# EAGLE design dos-partes (EAGLE 9.0.0)
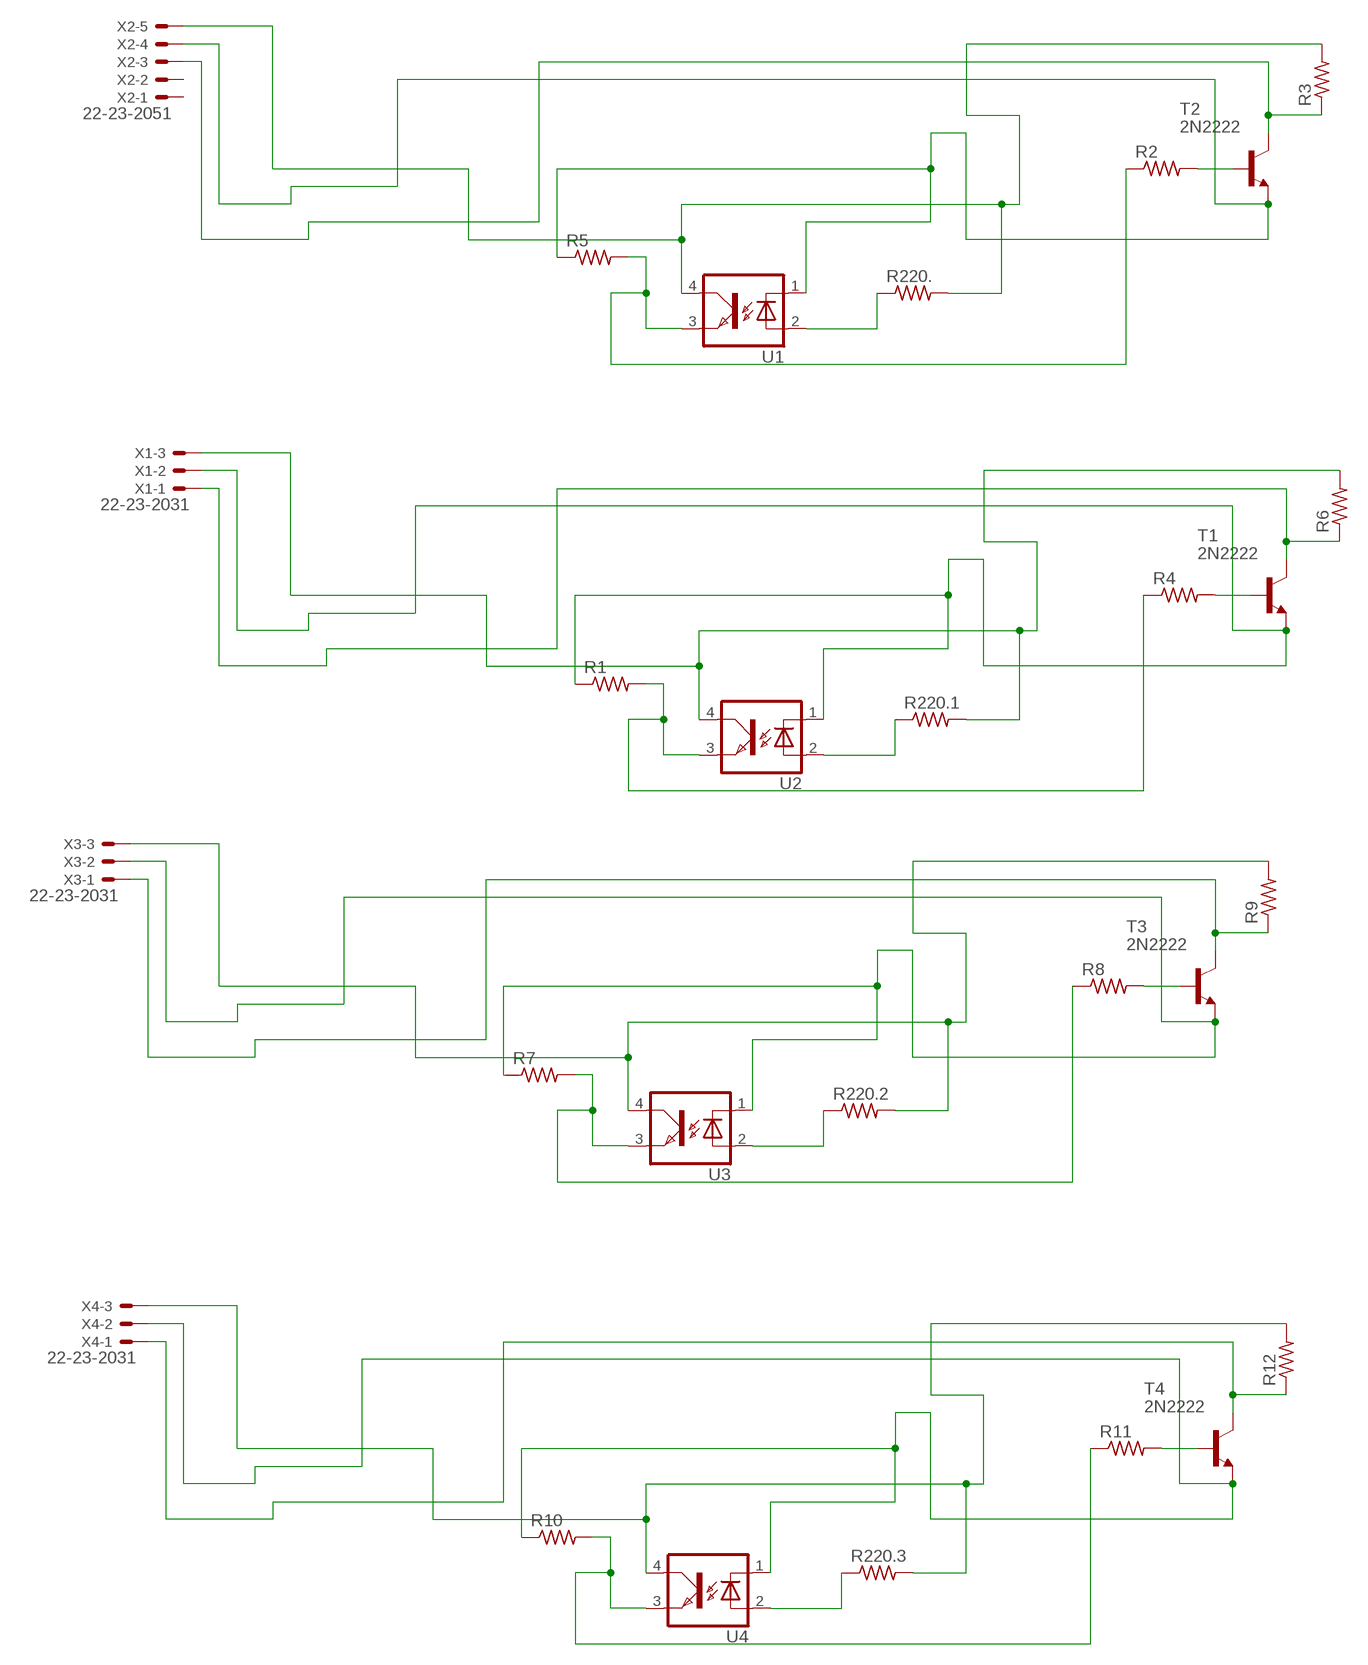
[diagram p0: schematic, sheet 1]

## Parts
R1  R-US_0204/7  [0204/7]
R2  R-US_0204/7  [0204/7]
R3  R-US_0204/7  [0204/7]
R4  R-US_0204/7  [0204/7]
R5  R-US_0204/7  [0204/7]
R6  R-US_0204/7  [0204/7]
R7  R-US_0204/7  [0204/7]
R8  R-US_0204/7  [0204/7]
R9  R-US_0204/7  [0204/7]
R10  R-US_0204/7  [0204/7]
R11  R-US_0204/7  [0204/7]
R12  R-US_0204/7  [0204/7]
R220.  R-US_0204/7  [0204/7]
R220.1  R-US_0204/7  [0204/7]
R220.2  R-US_0204/7  [0204/7]
R220.3  R-US_0204/7  [0204/7]
T1  2N2222  [TO18]
T2  2N2222  [TO18]
T3  2N2222  [TO18]
T4  2N2222  [TO18]
U1  CNY70  [CNY70]
U2  CNY70  [CNY70]
U3  CNY70  [CNY70]
U4  CNY70  [CNY70]
X1  22-23-2031  [22-23-2031]
X2  22-23-2051  [22-23-2051]
X3  22-23-2031  [22-23-2031]
X4  22-23-2031  [22-23-2031]

## Nets
N$1: R220..1 U1.2
N$4: R5.1 T2.1(E) U1.1 X2.4
N$5: R2.1 R5.2 U1.3
N$6: R2.2 T2.2(B)
N$7: R220.1.1 U2.2
N$8: R3.1 T2.3(C) X2.3
N$9: R1.2 R4.1 U2.3
N$10: R4.2 T1.2(B)
N$11: R1.1 T1.1(E) U2.1 X1.2
N$12: R3.2 R220..2 U1.4 X2.5
N$13: R6.2 R220.1.2 U2.4 X1.3
N$15: R220.2.1 U3.2
N$16: R7.2 R8.1 U3.3
N$17: R8.2 T3.2(B)
N$18: R7.1 T3.1(E) U3.1 X3.2
N$19: R9.2 R220.2.2 U3.4 X3.3
N$20: R9.1 T3.3(C) X3.1
N$22: R220.3.1 U4.2
N$23: R10.2 R11.1 U4.3
N$24: R11.2 T4.2(B)
N$25: R10.1 T4.1(E) U4.1 X4.2
N$26: R12.2 R220.3.2 U4.4 X4.3
N$27: R12.1 T4.3(C) X4.1
N$28: R6.1 T1.3(C) X1.1
Unconnected: X2.1 X2.2

## Library data of the parts
R1-R12 R220. R220.1-R220.3 = rcl:R-US_: RESISTOR, American symbol; SPICEPREFIX: R
T1-T4 = transistor:2N2222: NPN TRANSISTOR
U1-U4 = E&R_Sensores:CNY70: Sensor infrarrojo CNY70
X1 X3 X4 = con-molex:22-23-2031: .100" (2.54mm) Center Header - 3 Pin; MF: MOLEX; MPN: 22-23-2031; OC_FARNELL: 1462950; OC_NEWARK: 30C0862
X2 = con-molex:22-23-2051: .100" (2.54mm) Center Header - 5 Pin; MF: MOLEX; MPN: 22-23-2051; OC_FARNELL: 1462952; OC_NEWARK: 38C9178

## Board
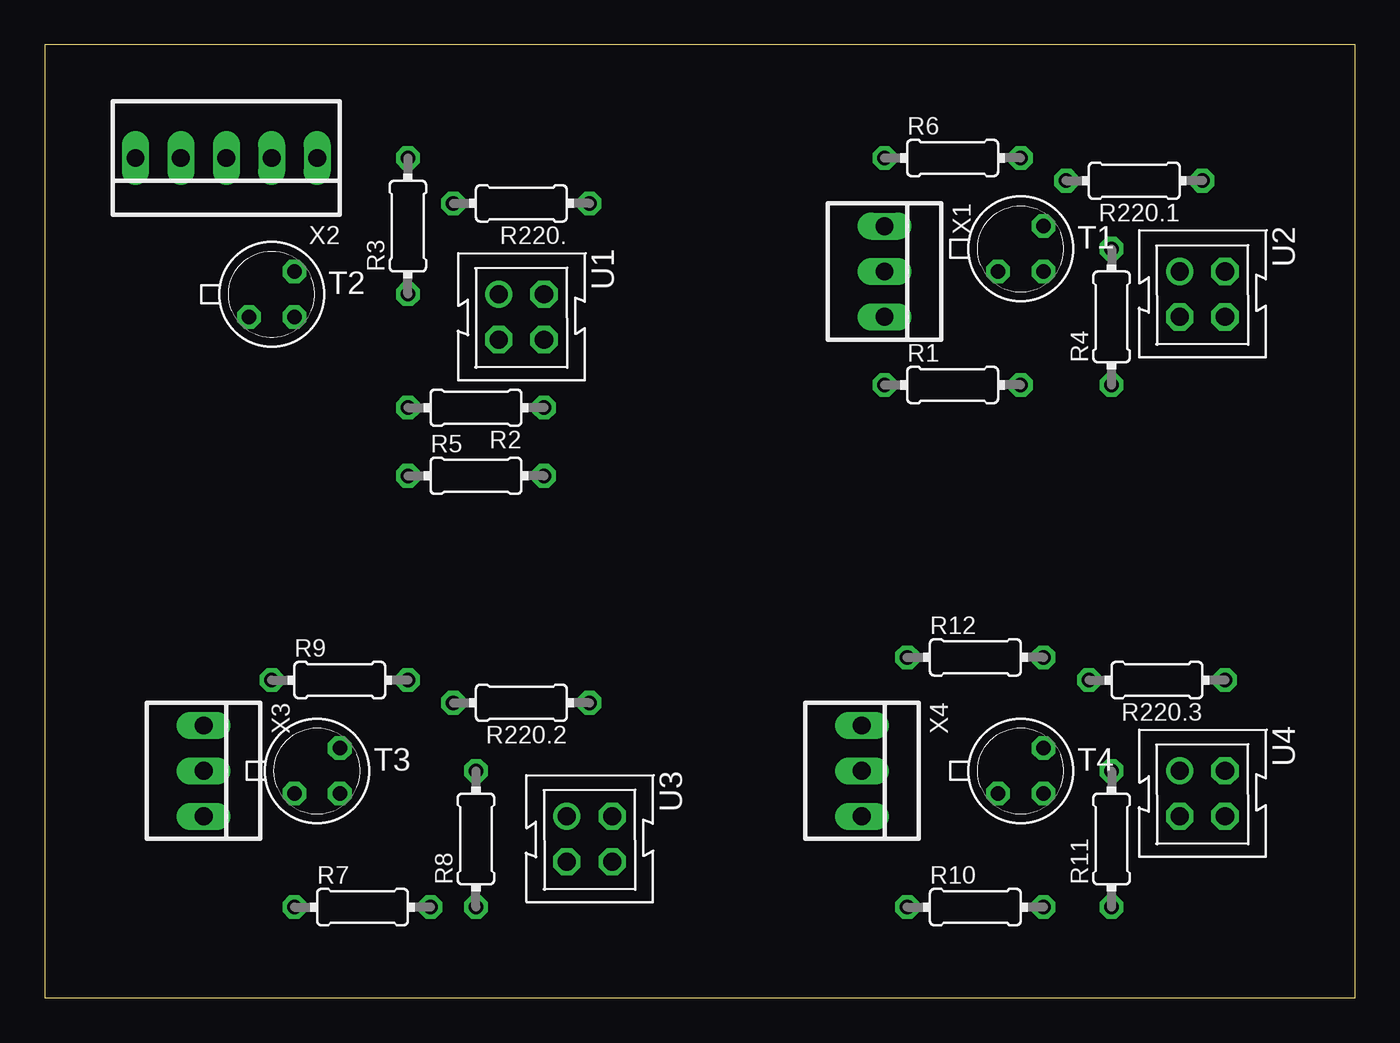
[diagram p1: board, top side]
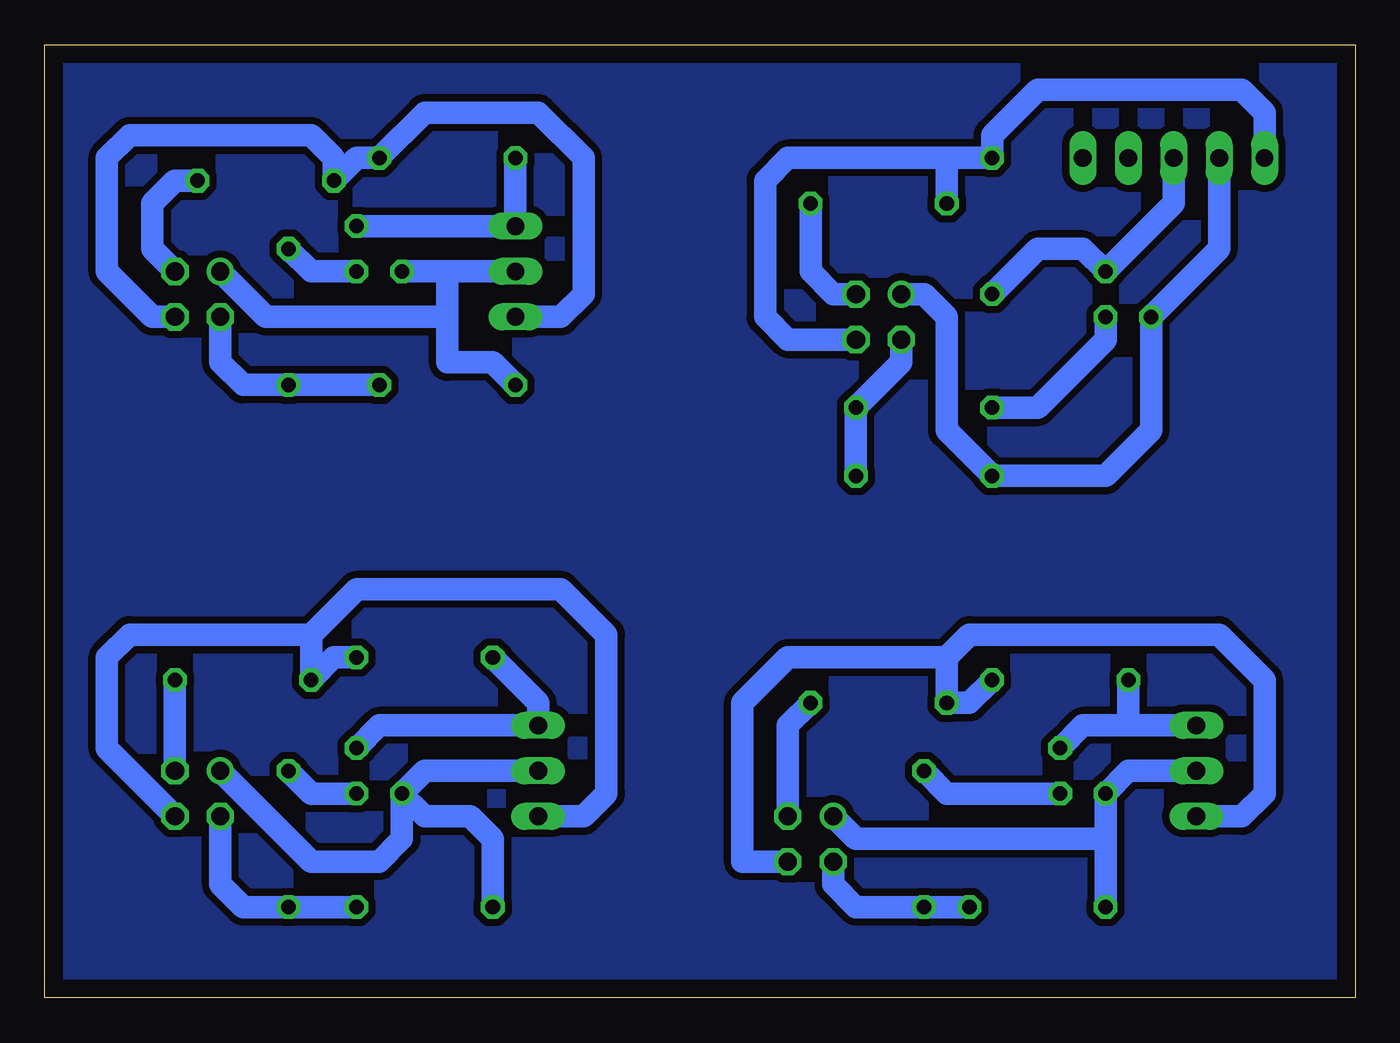
[diagram p2: board, bottom side, seen from below]

Size 73.33 x 53.33 mm. Coordinates in mm from the lower left corner, seen from the top.
Outline: 0,0 73.33,0 73.33,53.33 0,53.33 0,0
Copper layers (1*16): Top 0.035mm / dielectric 1.5mm / Bottom 0.035mm
Design rules "default": minimum track width 6mil, minimum drill 0.35mm, track to track 6mil, track to pad 6mil, pad to pad 6mil, via to via 6mil, smd to smd 6mil, copper to edge 40mil, drill to drill 6mil, minimum pad ring 10mil, minimum via ring 8mil, stop-mask expansion 4mil, vias tented up to drill 0mil, thermal gap 10mil

### Footprints (pad centres in the part's own frame; a part is rotated, then mirrored left to right if it is on the bottom)
0204/7 = drill 0.813 octagon: 1 -3.81,0; 2 3.81,0
TO18 = drill 0.813 octagon: 1 -1.27,-1.27; 2 1.27,-1.27; 3 1.27,1.27
CNY70 = drill 1.016: 1 -2.54,-1.27 | drill 1.016 octagon: 2 -2.54,1.27; 3 0,-1.27; 4 0,1.27
22-23-2031 = drill 1 long: 1 -2.54,0; 2 0,0; 3 2.54,0
22-23-2051 = drill 1 long: 1 -5.08,0; 2 -2.54,0; 3 0,0; 4 2.54,0; 5 5.08,0

### Placement (x,y rotation side)
R1  50.8,34.29 0 top
R2  24.13,33.02 180 top
R3  20.32,43.18 90 top
R4  59.69,38.1 90 top
R5  24.13,29.21 0 top
R6  50.8,46.99 0 top
R7  17.78,5.08 0 top
R8  24.13,8.89 90 top
R9  16.51,17.78 0 top
R10  52.07,5.08 0 top
R11  59.69,8.89 90 top
R12  52.07,19.05 0 top
R220.  26.67,44.45 180 top
R220.1  60.96,45.72 180 top
R220.2  26.67,16.51 180 top
R220.3  62.23,17.78 180 top
T1  54.61,41.91 0 top
T2  12.7,39.37 0 top
T3  15.24,12.7 0 top
T4  54.61,12.7 0 top
U1  26.67,36.83 270 top
U2  64.77,38.1 270 top
U3  30.48,7.62 270 top
U4  64.77,10.16 270 top
X1  46.99,40.64 270 top
X2  10.16,46.99 180 top
X3  8.89,12.7 270 top
X4  45.72,12.7 270 top

### Tracks (layer width: path | path; a pad name or v marks a point on that pad's centre or on a via)
N$1
  Bottom 1.27: R220..1 30.48,40.64 29.21,39.37 U1.2
N$2
  pour Bottom (isolate 0.406): 0,1.27 72.39,1.27 72.39,53.34 0,53.34
N$4
  Bottom 1.27: U1.1 24.13,39.37 22.86,38.1 22.86,31.75 R5.1 13.97,29.21 11.43,31.75 T2.1 7.62,41.91 X2.4
N$5
  Bottom 1.27: U1.3 25.4,35.56 R2.1 R5.2
N$6
  Bottom 1.27: R2.2 17.78,33.02 13.97,36.83 T2.2
N$7
  Bottom 1.27: R220.1.1 66.04,45.72 67.31,44.45 67.31,41.91 U2.2
N$8
  Bottom 1.27: R3.1 17.78,41.91 15.24,41.91 T2.3 10.16,44.45 X2.3
N$9
  Bottom 1.27: U2.3 63.5,35.56 62.23,34.29 R4.1 R1.2
N$10
  Bottom 1.27: T1.2 58.42,40.64 R4.2
N$11
  Bottom 1.27: X1.2 50.8,40.64 | 50.8,40.64 T1.1 | R1.1 48.26,35.56 50.8,35.56 50.8,38.1 | 50.8,38.1 50.8,40.64 | U2.1 60.96,38.1 50.8,38.1
N$12
  Bottom 1.27: X2.5 5.08,49.53 6.35,50.8 17.78,50.8 20.32,48.26 R3.2 22.86,46.99 | 22.86,46.99 31.75,46.99 33.02,45.72 33.02,38.1 31.75,36.83 U1.4 | R220..2 22.86,46.99
N$13
  Bottom 1.27: X1.3 44.45,38.1 43.18,39.37 43.18,46.99 45.72,49.53 52.07,49.53 R6.2 55.88,46.99 R220.1.2 57.15,46.99 58.42,48.26 68.58,48.26 69.85,46.99 69.85,40.64 67.31,38.1 U2.4
N$15
  Bottom 1.27: R220.2.1 31.75,15.24 U3.2
N$16
  Bottom 1.27: R7.2 R8.1 27.94,5.08 29.21,6.35 U3.3
N$17
  Bottom 1.27: R8.2 22.86,11.43 T3.2
N$18
  Bottom 1.27: X3.2 12.7,12.7 T3.1 13.97,8.89 | 13.97,8.89 R7.1 | U3.1 27.94,8.89 13.97,8.89
N$19
  Bottom 1.27: 22.86,19.05 R220.2.2 21.59,16.51 R9.2 | 22.86,19.05 21.59,20.32 7.62,20.32 5.08,17.78 5.08,11.43 6.35,10.16 X3.3 | U3.4 34.29,7.62 34.29,16.51 31.75,19.05 22.86,19.05
N$20
  Bottom 1.27: X3.1 12.7,15.24 | 12.7,15.24 15.24,15.24 T3.3 | R9.1 12.7,15.24
N$22
  Bottom 1.27: R220.3.1 U4.2
N$23
  Bottom 1.27: R10.2 R11.1 62.23,5.08 63.5,6.35 U4.3
N$24
  Bottom 1.27: T4.2 58.42,11.43 R11.2
N$25
  Bottom 1.27: X4.2 52.07,12.7 T4.1 | T4.1 52.07,10.16 49.53,10.16 48.26,8.89 R10.1 | U4.1 58.42,7.62 54.61,7.62 53.34,8.89 T4.1
N$26
  Bottom 1.27: R12.2 57.15,19.05 R220.3.2 58.42,20.32 | X4.3 43.18,10.16 41.91,11.43 41.91,20.32 44.45,22.86 55.88,22.86 58.42,20.32 | U4.4 69.85,13.97 69.85,19.05 68.58,20.32 58.42,20.32
N$27
  Bottom 1.27: T4.3 54.61,15.24 X4.1 45.72,16.51 R12.1
N$28
  Bottom 1.27: R6.1 X1.1 T1.3